# Altium schematic sheet Voltage_Translator.SchDoc: Voltage Translator
size 420 x 297 mm; SheetNumber: 4; SheetTotal: 9
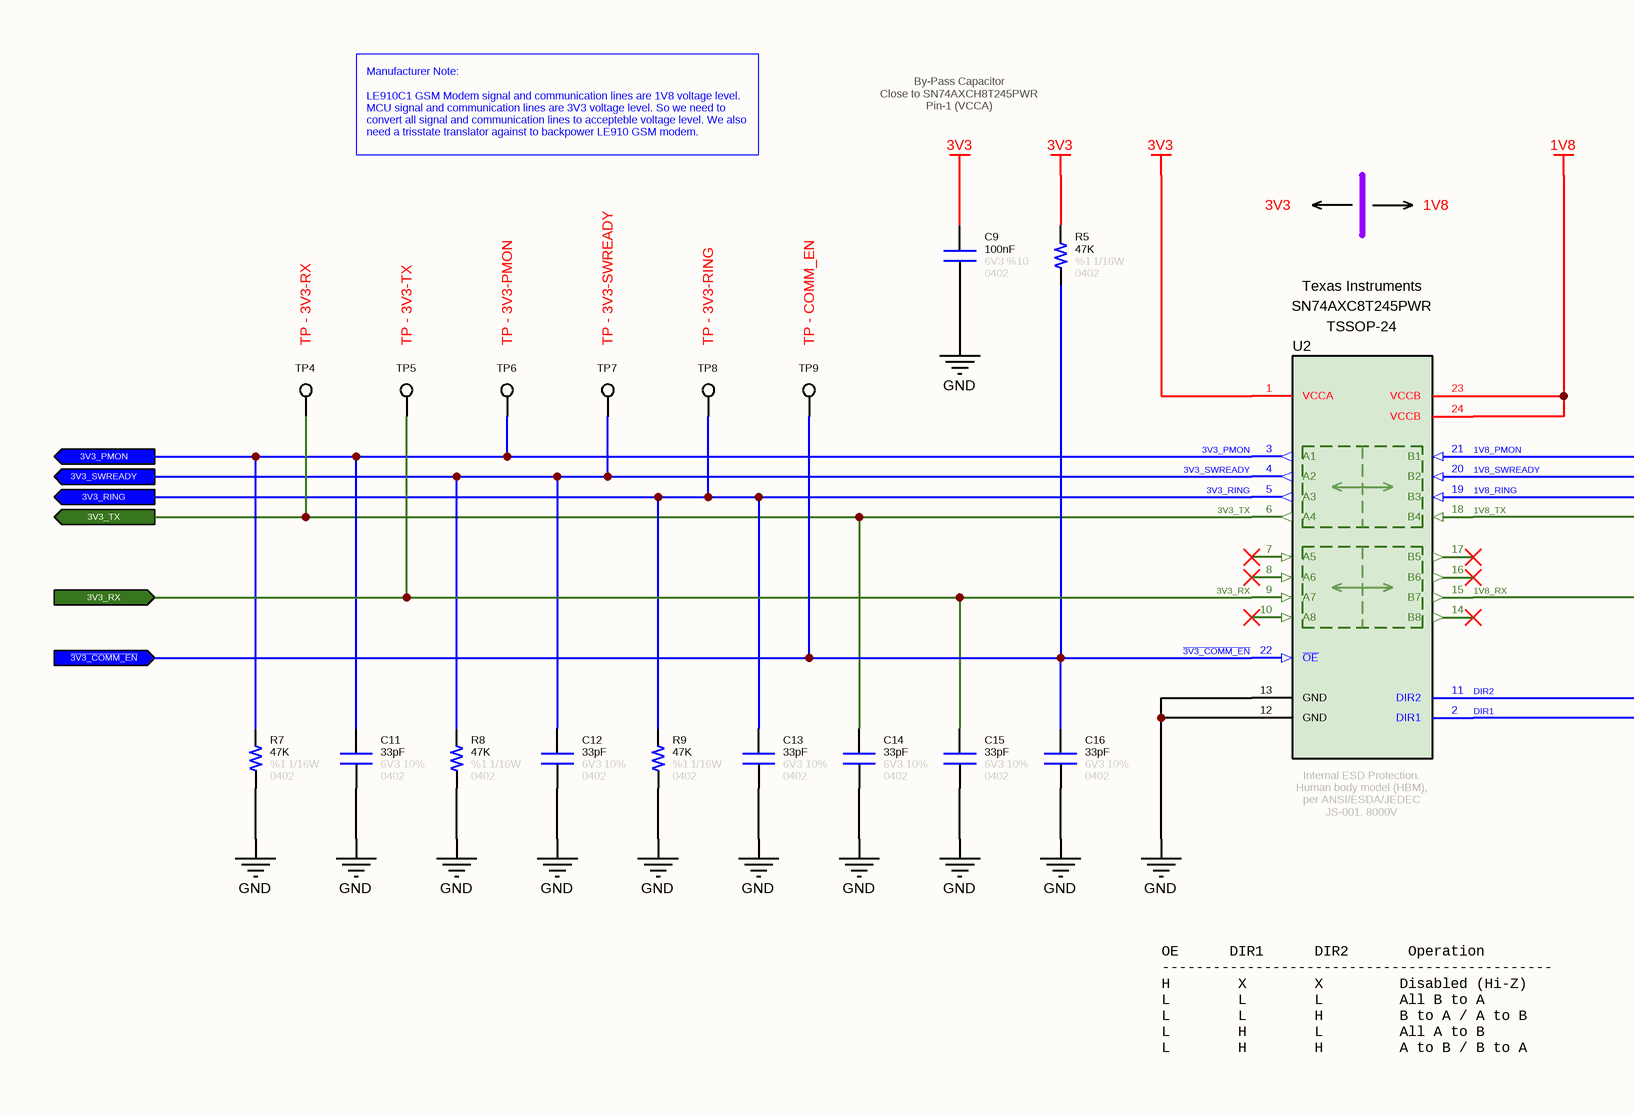
[diagram p0: Voltage_Translator.SchDoc, left]
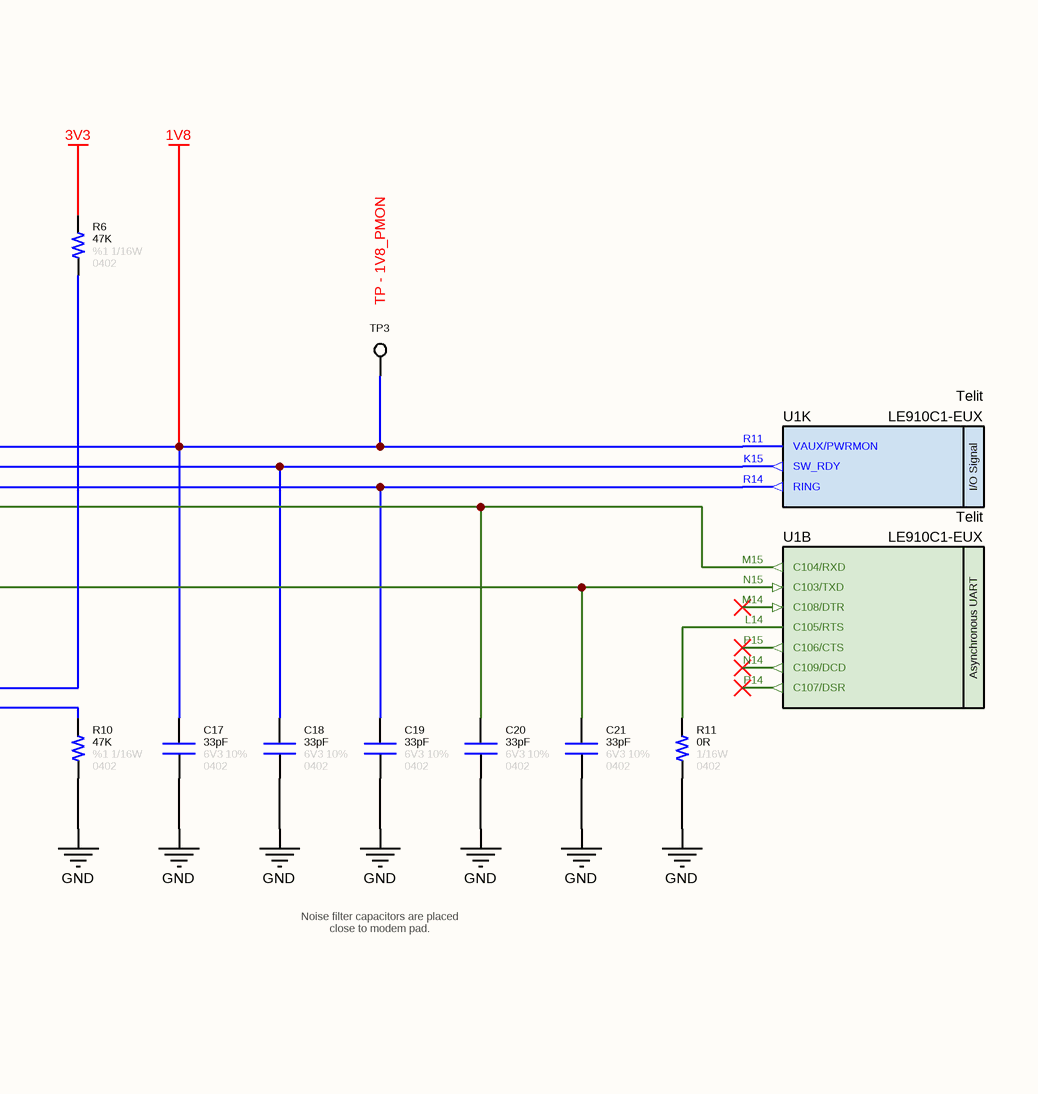
[diagram p1: Voltage_Translator.SchDoc, right]

## Parts
C9  value 100nF  Tolerance: %10  Voltage: 6V3  Case: 0402  [CAPACITOR_0402]  (hidden comment: Capacitor - 100nF [0402] (Ceramic))
C11  value 33pF  Tolerance: 10%  Case: 0402  Voltage: 6V3  [CAPACITOR_0402]  (hidden comment: Capacitor - 33pF [0402] (Ceramic))
C12  value 33pF  Tolerance: 10%  Case: 0402  Voltage: 6V3  [CAPACITOR_0402]  (hidden comment: Capacitor - 33pF [0402] (Ceramic))
C13  value 33pF  Tolerance: 10%  Case: 0402  Voltage: 6V3  [CAPACITOR_0402]  (hidden comment: Capacitor - 33pF [0402] (Ceramic))
C14  value 33pF  Tolerance: 10%  Case: 0402  Voltage: 6V3  [CAPACITOR_0402]  (hidden comment: Capacitor - 33pF [0402] (Ceramic))
C15  value 33pF  Tolerance: 10%  Case: 0402  Voltage: 6V3  [CAPACITOR_0402]  (hidden comment: Capacitor - 33pF [0402] (Ceramic))
C16  value 33pF  Tolerance: 10%  Case: 0402  Voltage: 6V3  [CAPACITOR_0402]  (hidden comment: Capacitor - 33pF [0402] (Ceramic))
C17  value 33pF  Tolerance: 10%  Case: 0402  Voltage: 6V3  [CAPACITOR_0402]  (hidden comment: Capacitor - 33pF [0402] (Ceramic))
C18  value 33pF  Tolerance: 10%  Case: 0402  Voltage: 6V3  [CAPACITOR_0402]  (hidden comment: Capacitor - 33pF [0402] (Ceramic))
C19  value 33pF  Tolerance: 10%  Case: 0402  Voltage: 6V3  [CAPACITOR_0402]  (hidden comment: Capacitor - 33pF [0402] (Ceramic))
C20  value 33pF  Tolerance: 10%  Case: 0402  Voltage: 6V3  [CAPACITOR_0402]  (hidden comment: Capacitor - 33pF [0402] (Ceramic))
C21  value 33pF  Tolerance: 10%  Case: 0402  Voltage: 6V3  [CAPACITOR_0402]  (hidden comment: Capacitor - 33pF [0402] (Ceramic))
R5  value 47K  Tolerance: %1  Case: 0402  Power: 1/16W  [RESISTOR_0402]  (hidden comment: 47K - 0402 - %1 - 1/16W)
R6  value 47K  Tolerance: %1  Case: 0402  Power: 1/16W  [RESISTOR_0402]  (hidden comment: 47K - 0402 - %1 - 1/16W)
R7  value 47K  Tolerance: %1  Case: 0402  Power: 1/16W  [RESISTOR_0402]  (hidden comment: 47K - 0402 - %1 - 1/16W)
R8  value 47K  Tolerance: %1  Case: 0402  Power: 1/16W  [RESISTOR_0402]  (hidden comment: 47K - 0402 - %1 - 1/16W)
R9  value 47K  Tolerance: %1  Case: 0402  Power: 1/16W  [RESISTOR_0402]  (hidden comment: 47K - 0402 - %1 - 1/16W)
R10  value 47K  Tolerance: %1  Case: 0402  Power: 1/16W  [RESISTOR_0402]  (hidden comment: 47K - 0402 - %1 - 1/16W)
R11  value 0R  Case: 0402  Power: 1/16W  [RESISTOR_0402]  (hidden comment: 0R - 0402 - %1 - 1/16W)
TP3  TP - 1V8_PMON  [TP]  (no BOM)
TP4  TP - 3V3-RX  [TP]  (no BOM)
TP5  TP - 3V3-TX  [TP]  (no BOM)
TP6  TP - 3V3-PMON  [TP]  (no BOM)
TP7  TP - 3V3-SWREADY  [TP]  (no BOM)
TP8  TP - 3V3-RING  [TP]  (no BOM)
TP9  TP - COMM_EN  [TP]  (no BOM)
U1  Manufacturer Part Number: LE910C1-EUX  Manufacturer Name: Telit  [LE910 GSM Modem]  (hidden comment: LE910C1-EUX LTE GSM Module)  (parts B,K of 19)
U2  Manufacturer Name: Texas Instruments  [TSSOP-24]  (hidden comment: SN74AXC8T245PWR)

## Ports
3V3_PMON (out), 3V3_RING (out), 3V3_RX (in), 3V3_SWREADY (out), 3V3_TX (out), ~{3V3_COMM_EN} (in)

## Nets
1V8_PMON: C17.2 TP3.1 U1.R11(VAUX/PWRMON) U2.21(B1) U2.23(VCCB) U2.24(VCCB)  [also labelled 1V8]
3V3: C9.2 R5.2 R6.2 U2.1(VCCA)
GND: C9.1 C11.1 C12.1 C13.1 C14.1 C15.1 C16.1 C17.1 C18.1 C19.1 C20.1 C21.1 R7.1 R8.1 R9.1 R10.1 R11.1 U2.12(GND) U2.13(GND)
1V8_RING: C19.2 U1.R14(RING) U2.19(B3)
1V8_RX: C21.2 U1.N15(C103/TXD) U2.15(B7)
1V8_SWREADY: C18.2 U1.K15(SW_RDY) U2.20(B2)
1V8_TX: C20.2 U1.M15(C104/RXD) U2.18(B4)
~{3V3_COMM_EN}: C16.2 R5.1 TP9.1 U2.22(~{OE}) ; port ~{3V3_COMM_EN}
3V3_PMON: C11.2 R7.2 TP6.1 U2.3(A1) ; port 3V3_PMON
3V3_RING: C13.2 R9.2 TP8.1 U2.5(A3) ; port 3V3_RING
3V3_RX: C15.2 TP5.1 U2.9(A7) ; port 3V3_RX
3V3_SWREADY: C12.2 R8.2 TP7.1 U2.4(A2) ; port 3V3_SWREADY
3V3_TX: C14.2 TP4.1 U2.6(A4) ; port 3V3_TX
DIR1: R10.2 U2.2(DIR1)
DIR2: R6.1 U2.11(DIR2)
NetR11_2: R11.2 U1.L14(C105/RTS)

Not connected (* = marked no-connect by the designer): U1 M14(C108/DTR)* N14(C109/DCD)* P14(C107/DSR)* P15(C106/CTS)*; U2 7(A5)* 8(A6)* 10(A8)* 14(B8)* 16(B6)* 17(B5)*

## Notes on the sheet
- Manufacturer Note:
  LE910C1 GSM Modem signal and communication lines are 1V8 voltage level.  MCU signal and communication lines are 3V3 voltage level. So we need to convert all signal and communication lines to accepteble voltage level. We also need a trisstate translator against to backpower LE910 GSM modem.
- By-Pass Capacitor
  Close to SN74AXCH8T245PWR
  Pin-1 (VCCA)
- 3V3
- 1V8
- Noise filter capacitors are placed close to modem pad.
- OE      DIR1      DIR2       Operation
  ----------------------------------------------
  H        X        X         Disabled (Hi-Z)
  L        L        L         All B to A
  L        L        H         B to A / A to B
  L        H        L         All A to B
  L        H        H         A to B / B to A
- © 2026 All rights reserved.
  This document may not, in whole or in part, be copied, photocopied, reproduced, translated or converted to any electronic or machine readable from without prior written permission of Mehmet Günce Akkoyun.
  Engineer contact : akkoyun@me.com
- Property of
- Engineer :
- Date :
- Size :
- A4
- Time :
- Project :
- Page :
- /
- Customer :
- Product ID :
- Module ID :
- Version :
- File :
- Revision :
- (in symbol IC - LE910C1-EUX, part B) Asynchronous UART
- (in symbol IC - LE910C1-EUX, part K) I/O Signal
- (in symbol IC - SN74AXC8T245PWR) Internal ESD Protection. / Human body model (HBM), per ANSI/ESDA/JEDEC JS-001. 8000V

## Library data of the parts
C9 = Capacitor - 100nF [0402-6V3]: Capacitor - 100nF [0402-6V3] (Ceramic); Manufacturer Name: AVX; Manufacturer Part Number: 04026D104KAT4A; ComponentLink1Description: Mouser; ComponentLink1URL: https://www.mouser.com.tr/ProductDetail/AVX/04026D104KAT4A?qs=sGAEpiMZZMs0AnBnWHyRQPg4iYkCw7IMED%2F4kpqgf7w%3D; ComponentLink2Description: DataSheet; ComponentLink2URL: https://www.mouser.com.tr/datasheet/2/40/cx5r-776519.pdf
C11-C21 = Capacitor - 33pF [0402-6V3]: Manufacturer Name: Kemet; Manufacturer Part Number: C0402C330J9RACAUTO; ComponentLink1Description: DataSheet; ComponentLink1URL: https://api.kemet.com/component-edge/download/datasheet/C0402C330J9RACAUTO.pdf; ComponentLink2Description: Mouser; ComponentLink2URL: https://www.mouser.com/Search/Refine.aspx?Keyword=80-C0402C330J9RAUTO
R5-R10 = Resistor - 47K [0402]: Thick Film Resistors - SMD 1/16 W 47 KOhm 1%; Manufacturer Name: Vishay; Manufacturer Part Number: CRCW040247K0FKED; ComponentLink1Description: DataSheet; ComponentLink1URL: https://www.mouser.com.tr/datasheet/2/427/dcrcwe3-1762152.pdf; ComponentLink2Description: Mouser; ComponentLink2URL: https://www.mouser.com.tr/ProductDetail/Vishay-Dale/CRCW040247K0FKED?qs=sGAEpiMZZMu61qfTUdNhG2DpbjADlD3GL%252B3h1elTxqU%3D
R11 = Resistor - 0R [0402]: Thick Film Resistors - SMD 1/16 W 0 Ohm; Manufacturer Name: Vishay; Manufacturer Part Number: CRCW04020000Z0ED; ComponentLink1Description: DataSheet; ComponentLink1URL: https://www.mouser.com.tr/datasheet/2/427/dcrcwe3-1762152.pdf; ComponentLink2Description: Mouser; ComponentLink2URL: https://www.mouser.com.tr/ProductDetail/Vishay-Dale/CRCW04020000Z0ED?qs=sGAEpiMZZMu61qfTUdNhG2DpbjADlD3GG34cJb50zyg%3D
TP3-TP9 = PCB - Test Point: Test Point
U1 = IC - LE910C1-EUX: Telit LE910C1-EUX LTE/2G GSM Module; Case: BGA
U2 = IC - SN74AXC8T245PWR: Translation - Voltage Levels 8-Bit Dual-Supply Bus Transceiver 24-TSSOP -40 to 125; Number of Channels: 8 Channel; Logic Family: AXC; Data Rate: 380Mbps; Channel Type: Bidirectional; Supply Voltage - Min: 0V65; Supply Voltage - Max: 3V6; Output Type: Tri-State, Non-Inverted; Operating Supply Current: 60 uA; Propagation Delay Time: 4 ns; ROHS: Yes; Minimum Operating Temperature: - 40 C; Product Type: Translation - Voltage Levels; Maximum Operating Temperature: + 125 C; Manufacturer Part Number: SN74AXC8T245PWR; Case: TSSOP-24